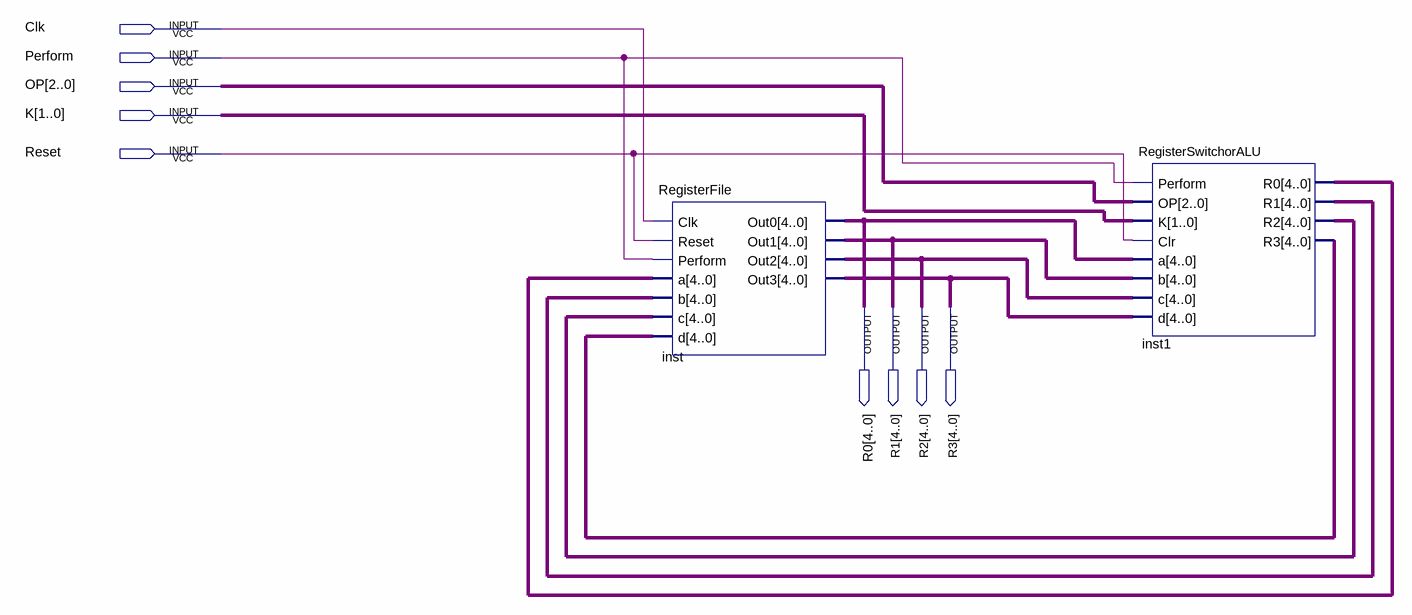
[diagram p0: schematic sheet]
// Quartus schematic CalcBlock.bdf as structural Verilog: 2 symbols, 9 pins
module CalcBlock (
  input  Clk,
  input  Perform,
  input  [2:0] OP,
  input  [1:0] K,
  input  Reset,
  output [4:0] R0,
  output [4:0] R1,
  output [4:0] R2,
  output [4:0] R3
);

  wire [4:0] inst1_r0, inst1_r1, inst1_r2, inst1_r3;

  RegisterFile inst (
    .Clk(Clk), .Reset(Reset), .Perform(Perform), .a(inst1_r0), .b(inst1_r1), .c(inst1_r2), .d(inst1_r3),
    .Out0(R0), .Out1(R1), .Out2(R2), .Out3(R3));
  RegisterSwitchorALU inst1 (
    .Perform(Perform), .OP(OP), .K(K), .Clr(Reset), .a(R0), .b(R1), .c(R2), .d(R3), .R0(inst1_r0),
    .R1(inst1_r1), .R2(inst1_r2), .R3(inst1_r3));
endmodule
